# EasyEDA Pro project ProDocument_自动剪刀_2024-02-25.epro

# Schematic 自动剪刀
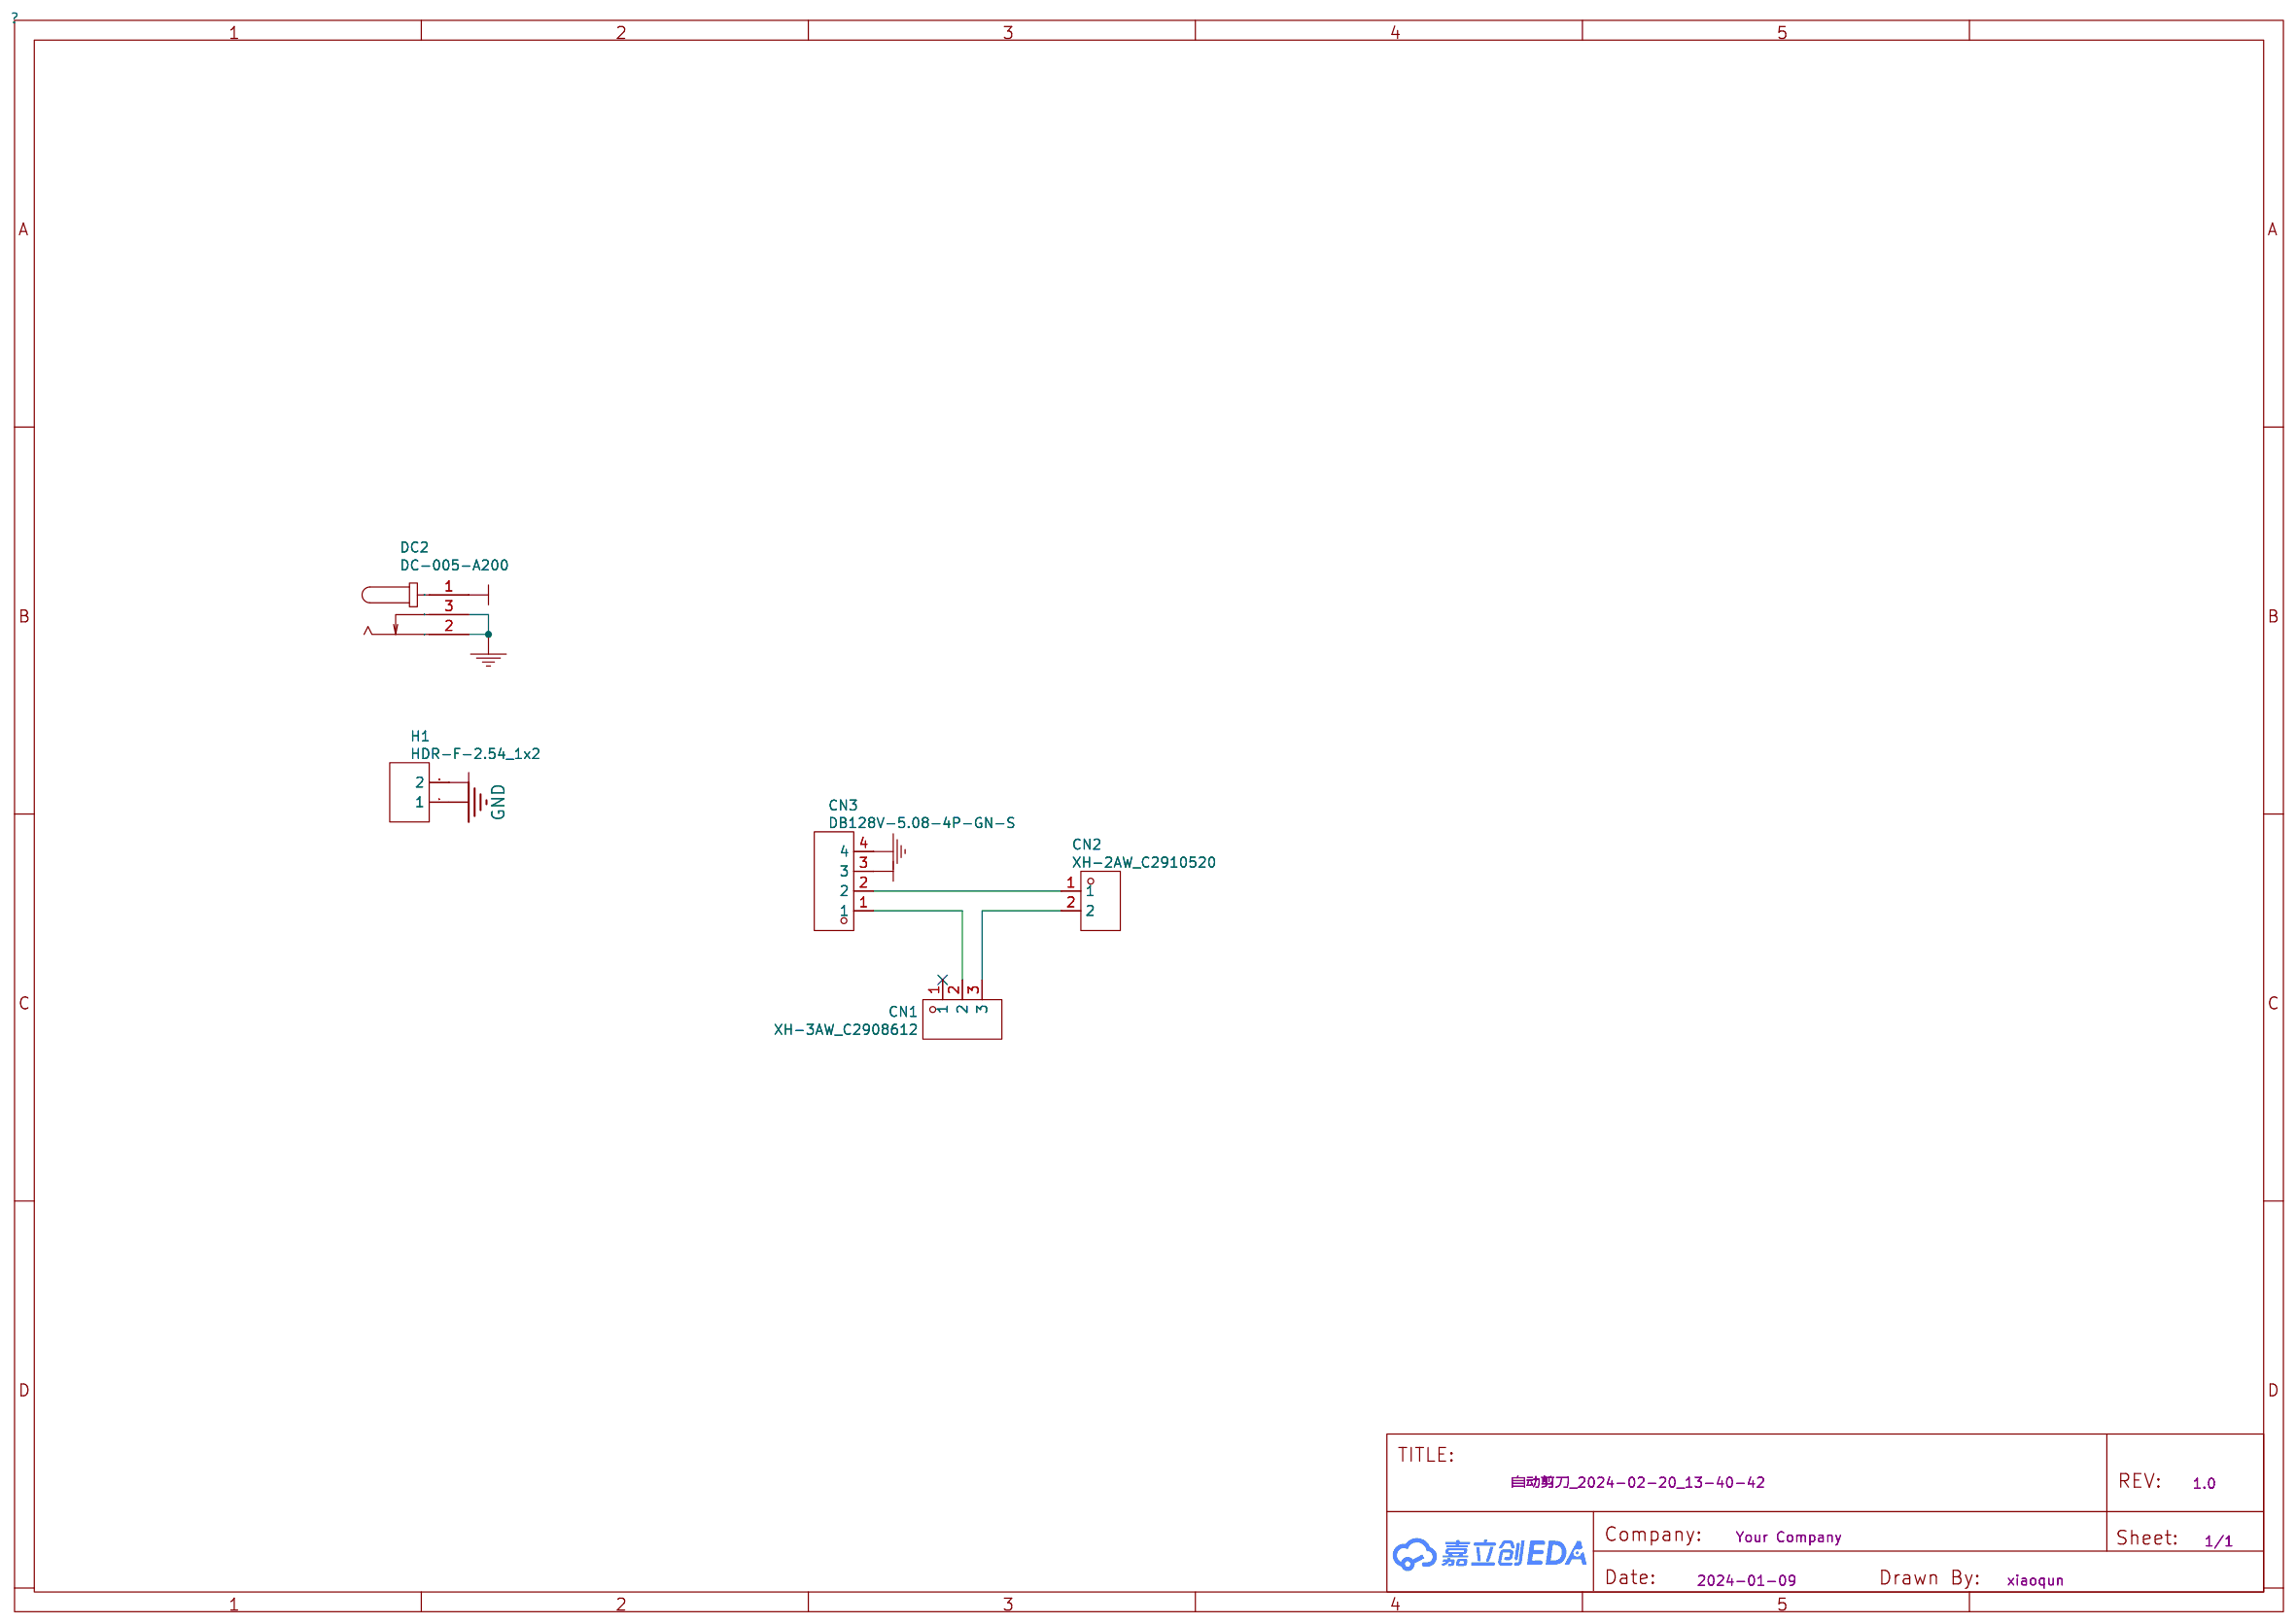
[diagram p0: schematic sheet]

## Parts
CN1  XH-3AW_C2908612  [CONN-TH_3P-P2.54_HCTL_XH-3AW]
CN2  XH-2AW_C2910520  [CONN-TH_2P-P2.50_XH-2AW]
CN3  DB128V-5.08-4P-GN-S  [CONN-TH_4P-P5.08_DIBO_DB128V-5.08]
DC2  DC-005-A200  [DC-IN-TH_DC-005-A200]
H1  HDR-F-2.54_1x2  [HDR-F-2.54_1X2]

## Library data of the parts
CN1 = XH-3AW_C2908612: Supplier: LCSC; Supplier Part: C2908612; Manufacturer: HCTL(华灿天禄); Manufacturer Part: XH-3AW; JLCPCB Part Class: Extended Part
CN2 = XH-2AW_C2910520: Supplier: LCSC; Supplier Part: C2910520; Manufacturer: 韩国韩荣; Manufacturer Part: XH-2AW; JLCPCB Part Class: Extended Part
CN3 = DB128V-5.08-4P-GN-S: Supplier: LCSC; Supplier Part: C2915641; Manufacturer: DORABO(地博电气); JLCPCB Part Class: Extended Part
DC2 = DC-005-A200: Supplier: LCSC; Supplier Part: C720557; Manufacturer: XUNPU(讯普); JLCPCB Part Class: Extended Part
H1 = HDR-F-2.54_1x2: Supplier Part: C49661; Supplier: LCSC

## Nets
GND: CN3.4 DC2.2 DC2.3 H1.1
VCC: CN3.3 DC2.1 H1.2
$1N2: CN2.1 CN3.2
$1N5: CN1.2 CN3.1
$1N6: CN1.3 CN2.2

Not connected (* = marked no-connect by the designer): CN1 1*

# Board PCB_自动剪刀
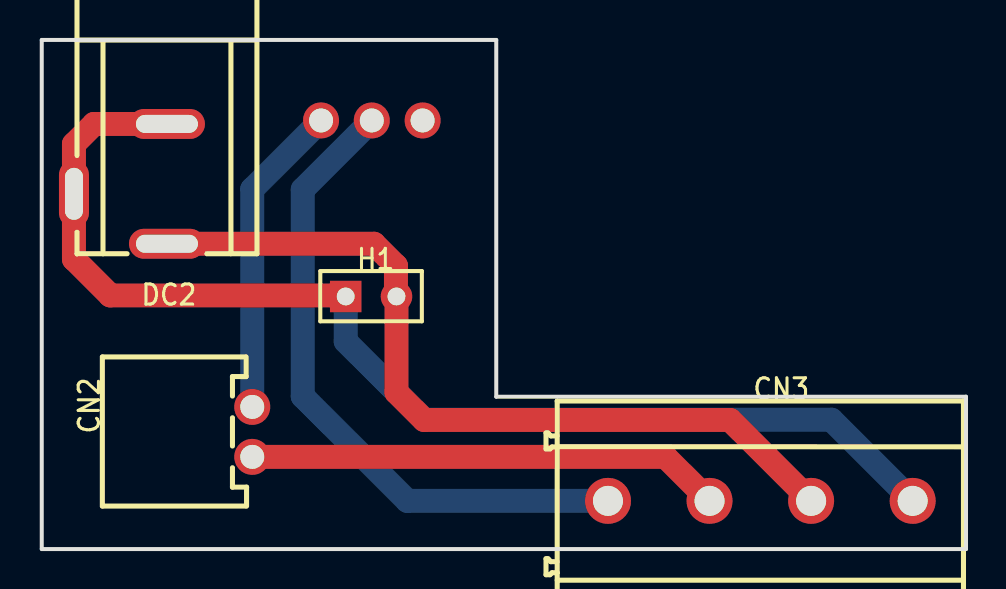
[diagram p1: board, top side]
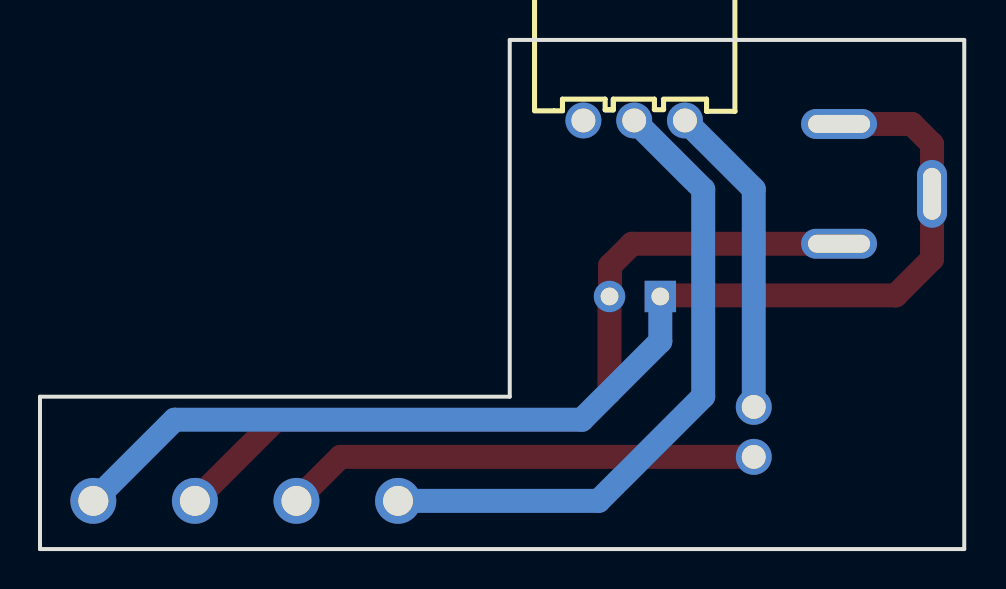
[diagram p2: board, bottom side, seen from below]

Outline 46.23 x 25.5 mm; copper layers: Top Layer, Bottom Layer. Coordinates in mm from the lower left corner of the outline.
Outline path: 0,25.5 22.73,25.5 22.73,7.63 46.23,7.63 46.23,0 0,0 0,25.5
Stack: Top Layer 0.035mm / Dielectric1 1.51mm FR4 er 4.5 / Bottom Layer 0.035mm

## Design rules (mm)
spacing Default (default): track to track 0.152, other pairs 0 to 0.152
track width Default (default): min 0.254, default 0.254, max 25.4
differential pair differentialPair (default): width min 0.127, default 0.254, max 2.54; gap min 0.152, default 0.152
via Default (default): diameter min 0.61, default 0.61, max 100.025; hole min 0.305, default 0.305, max 59.995

## Placement (name value [footprint] x y rotation side)
CN1  XH-3AW_C2908612  [CONN-TH_3P-P2.54_HCTL_XH-3AW]  16.51 21.46 180 bottom
CN2  XH-2AW_C2910520  [CONN-TH_2P-P2.50_XH-2AW]  10.53 5.87 90 top
CN3  DB128V-5.08-4P-GN-S  [CONN-TH_4P-P5.08_DIBO_DB128V-5.08]  35.94 2.41 0 top
DC2  DC-005-A200  [DC-IN-TH_DC-005-A200]  3.94 18.29 270 top
H1  HDR-F-2.54_1x2  [HDR-F-2.54_1X2]  16.47 12.65 0 top

## Footprints (pads in the part's own frame, mm; a bottom-side part is the same pattern mirrored in y, then rotated)
CONN-TH_2P-P2.50_XH-2AW
  round 1.8 hole 1.199: 1(-1.251,0) 2(1.251,0)
CONN-TH_3P-P2.54_HCTL_XH-3AW
  round 1.8 hole 1.199: 1(-2.54,0) 2(0.002,0) 3(2.54,0)
CONN-TH_4P-P5.08_DIBO_DB128V-5.08
  round 2.3 hole 1.5: 1(-7.62,0) 2(-2.54,0) 3(2.54,0) 4(7.62,0)
DC-IN-TH_DC-005-A200
  oval 1.5x3.8 hole 0.9x3.1: 1(2.999,2.325) 2(-3,2.325)
  oval 3.4x1.5 hole 2.6x0.9: 3(0.5,-2.325)
HDR-F-2.54_1X2
  rect 1.575x1.575 hole 0.889: 1(-1.27,0)
  round 1.575 hole 0.889: 2(1.27,0)

## Nets
As in the schematic.

Pads without a net: CN1 1

## Routing (per net, layer and track width the routed paths; a pad name or vN(x,y) marks a point on that pad's centre or on a via; arc(x,y) is an arc through that point)
GND: length 59.1
  Top Layer w1.2: H1.1 15.15,12.7 3.43,12.7 1.61,14.52 DC2.3 1.61,20.28 2.62,21.29 DC2.2
  Bottom Layer w1.2: CN3.4 39.5,6.48 19.13,6.48 15.2,10.4 H1.1
VCC: length 41.2
  Top Layer w1.2: DC2.1 16.61,15.29 17.72,14.19 17.72,12.67 H1.2 17.74,7.85 19.13,6.46 34.43,6.46 CN3.3
$1N2: length 23.8
  Top Layer w1.2: CN2.1 31.2,4.62 CN3.2
$1N5: length 32.7
  Bottom Layer w1.2: CN3.1 18.29,2.41 13.06,7.65 13.06,18.01 CN1.2
$1N6: length 15.8
  Bottom Layer w1.2: CN2.2 10.53,18.02 CN1.3
